# EAGLE design power (EAGLE 9.2.2)
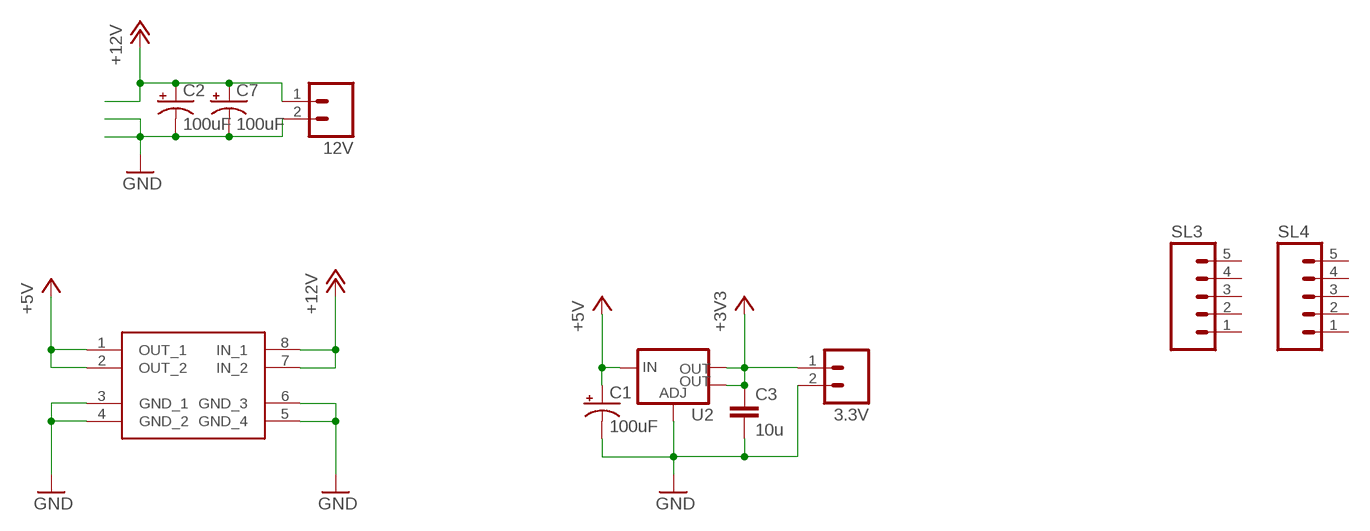
[diagram p0: schematic, sheet 1]

## Parts
3.3V  M02  [02P]
12V  M02  [02P]
C1  100uF  100UF-POLAR-EIA7343-16V-10%(TANT)  [EIA7343]
C2  100uF  100UF-POLAR-EIA7343-16V-10%(TANT)  [EIA7343]
C3  10u  C-EUC1206  [C1206]
C7  100uF  100UF-POLAR-EIA7343-16V-10%(TANT)  [EIA7343]
SL3  M05  [05P]
SL4  M05  [05P]
U2  V_REG_LM1117SOT223  [SOT223]
U$1  MP1584_MODUL  [MP1584_MODUL]

## Nets
+3V3: 3.3V.1 C3.1 U2.2(OUT) U2.4(OUT)
+5V: C1.A(+) U2.3(IN) U$1.1(OUT_1) U$1.2(OUT_2)
+12V: 12V.1 C2.A(+) C7.A(+) U$1.7(IN_2) U$1.8(IN_1)
GND: 3.3V.2 12V.2 C1.C(-) C2.C(-) C3.2 C7.C(-) U2.1(ADJ) U$1.3(GND_1) U$1.4(GND_2) U$1.5(GND_4) U$1.6(GND_3)
Unconnected: SL3.1 SL3.2 SL3.3 SL3.4 SL3.5 SL4.1 SL4.2 SL4.3 SL4.4 SL4.5

## Library data of the parts
3.3V 12V = con-amp-quick:M02: AMP QUICK CONNECTOR; OC_FARNELL: unknown; OC_NEWARK: unknown
C1 C2 C7 = SparkFun-Capacitors:100UF-POLAR: 100µF polarized capacitors A capacitor is a passive two-terminal electrical component used to store electrical energy temporarily in an electric field.; PROD_ID: CAP-08702
C3 = rcl:C-EU: CAPACITOR, European symbol; SPICEPREFIX: C
SL3 SL4 = con-amp-quick:M05: AMP QUICK CONNECTOR; OC_FARNELL: unknown; OC_NEWARK: unknown
U2 = SparkFun-IC-Power:V_REG_LM1117: Voltage Regulator LM1117 Standard adjustable voltage regulator but in SMD form. Spark Fun Electronics SKU : COM-00595; PROD_ID: VREG-08170
U$1 = my_components:MP1584_MODUL

## Board
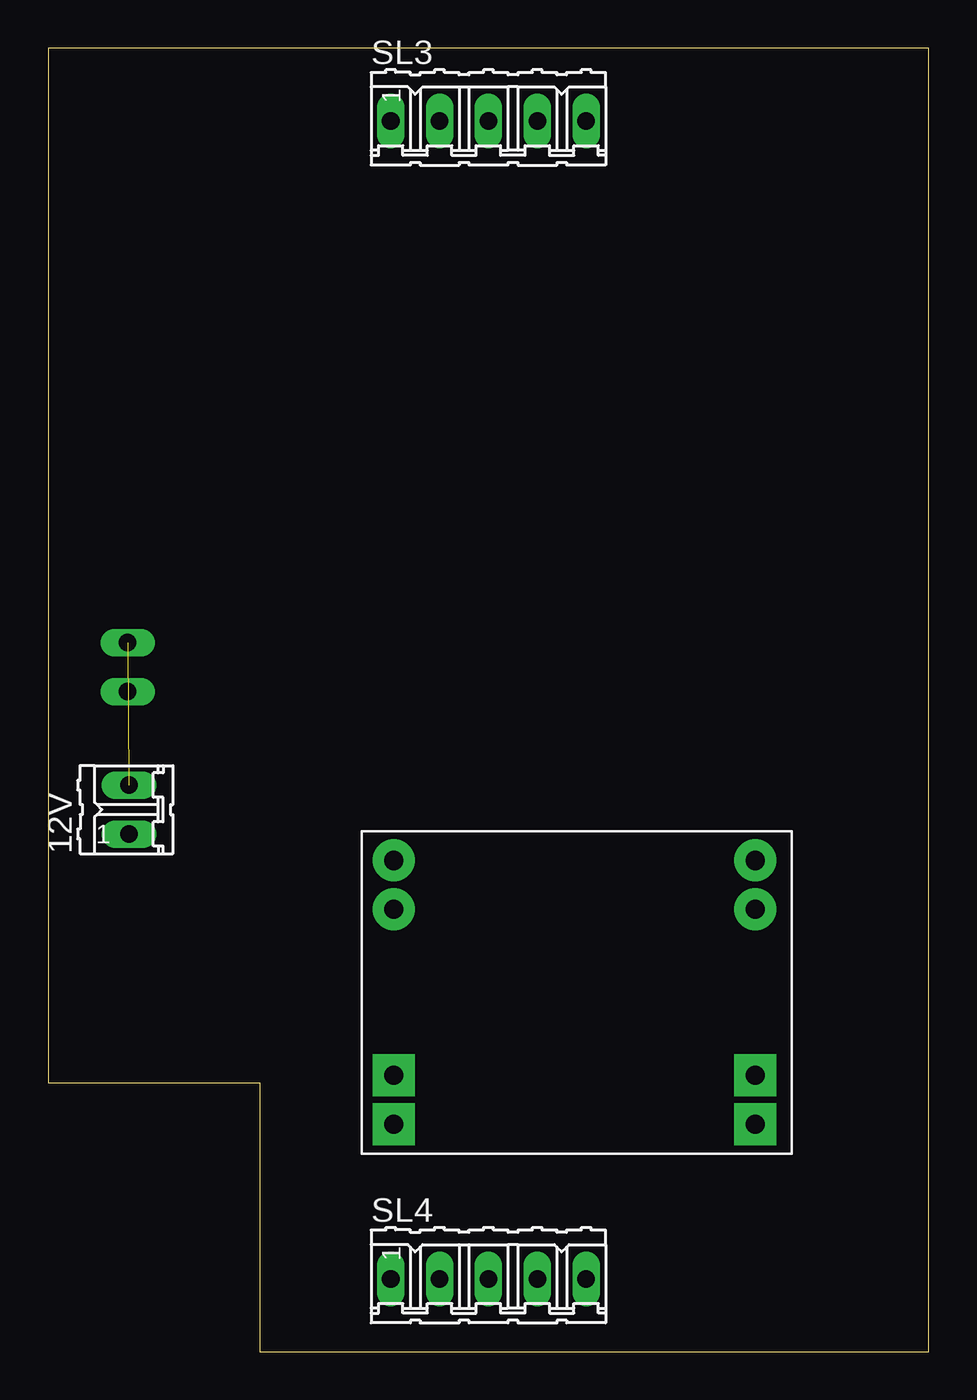
[diagram p1: board, top side]
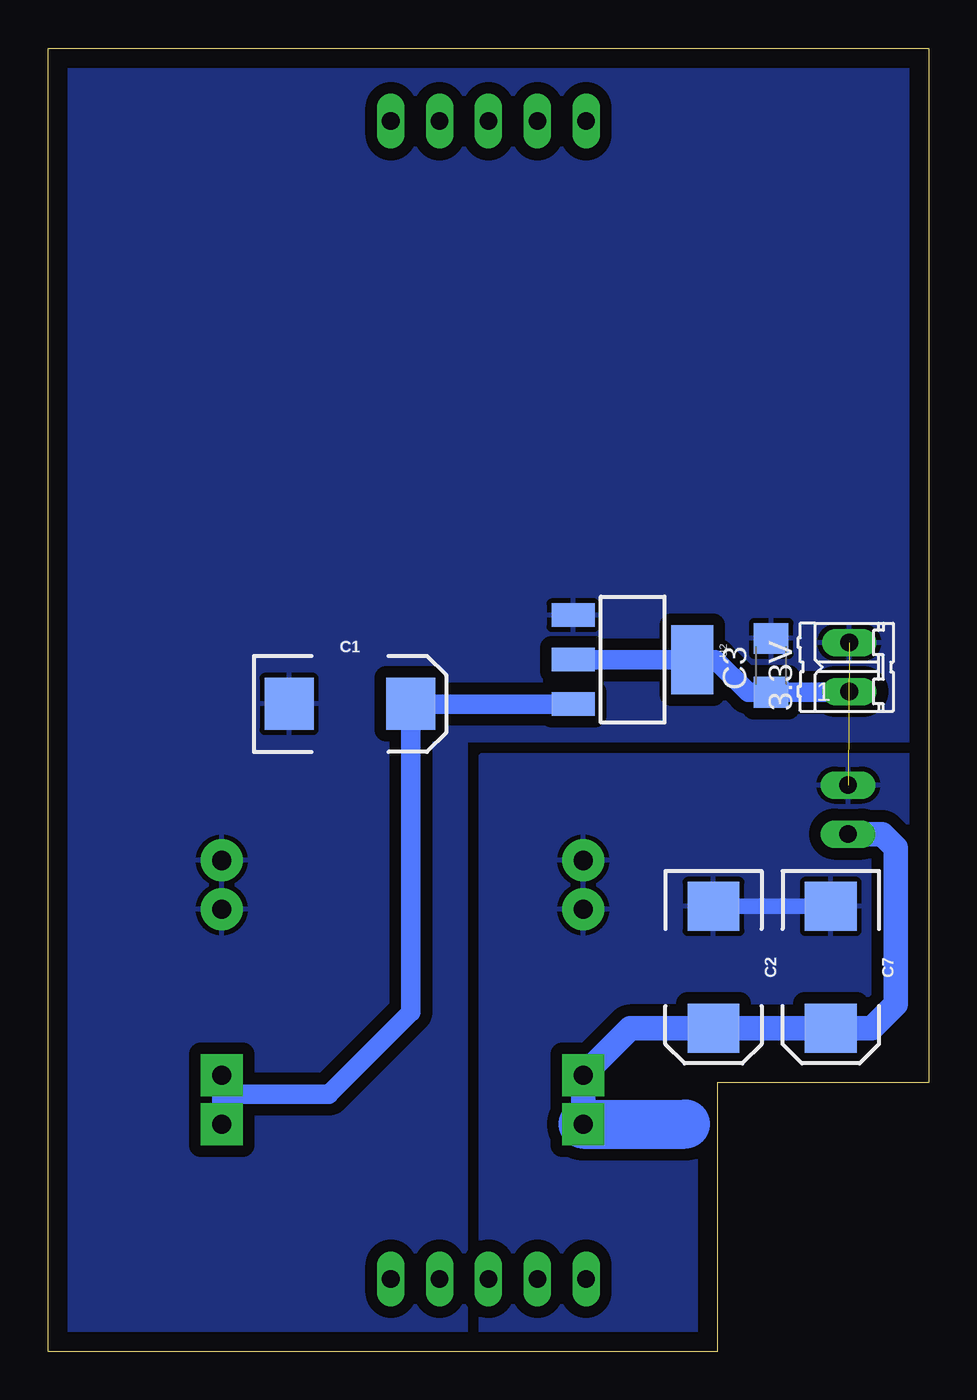
[diagram p2: board, bottom side, seen from below]

Size 45.8 x 67.8 mm. Coordinates in mm from the lower left corner, seen from the top.
Outline: 11,0 45.8,0 45.8,67.8 0,67.8 0,14 11,14 11,0
Copper layers (1*16): Top 0.035mm / dielectric 1.5mm / Bottom 0.035mm
Design rules "default": minimum track width 10mil, minimum drill 24mil, track to track 8mil, track to pad 8mil, pad to pad 8mil, via to via 8mil, smd to smd 8mil, copper to edge 40mil, drill to drill 8mil, minimum pad ring 10mil, minimum via ring 8mil, stop-mask expansion 4mil, vias tented up to drill 0mil, thermal gap 10mil

### Footprints (pad centres in the part's own frame; a part is rotated, then mirrored left to right if it is on the bottom)
02P = drill 0.914 long: 1 -1.27,0; 2 1.27,0
EIA7343 = smd 2.55 x 2.7: A 3.17,0; C -3.17,0
C1206 = smd 1.6 x 1.8: 1 -1.4,0; 2 1.4,0
05P = drill 0.914 long: 1 -5.08,0; 2 -2.54,0; 3 0,0; 4 2.54,0; 5 5.08,0
SOT223 = smd 1.219 x 2.235: 1 -2.311,-3.099; 2 0,-3.099; 3 2.311,-3.099 | smd 3.6 x 2.2: 4 0,3.099
MP1584_MODUL = drill 1 pad 2.184 square: 1 -9.271,6.858; 2 -9.271,4.318; 7 9.525,4.318; 8 9.525,6.858 | drill 1 pad 2.184: 3 -9.271,-4.318; 4 -9.271,-6.858; 5 9.525,-6.858; 6 9.525,-4.318

### Placement (x,y rotation side)
3.3V  4.14,35.61 90 bottom
12V  4.2,28.2 90 top
C1  30.1,33.7 0 bottom
C2  11.2,20 270 bottom
C3  8.2,35.7 90 bottom
C7  5.1,20 270 bottom
SL3  22.9,64 0 top
SL4  22.9,3.8 0 top
U2  15.4,36 270 bottom
U$1  27.5,18.7 180 top

### Tracks (layer width: path | path; a pad name or v marks a point on that pad's centre or on a via)
+3V3
  Bottom 1.016: 8.2,34.34 C3.1 | C3.1 4.14,34.3 3.3V.1 | C3.1 9.4,34.3 11.1,36 U2.4 U2.2
+5V
  Bottom 1.016: U$1.1 36.77,13.3 | 36.77,13.3 U$1.2 | U2.3 C1.A 26.93,17.67 31.2,13.4 36.67,13.4 36.77,13.3
+12V
  Bottom 1.27: U$1.8 U$1.7 15.53,16.83 C2.A C7.A 2.97,16.83 1.73,18.07 1.73,26.23 2.43,26.93 12V.1
  Bottom 2.54: U$1.8 12.66,11.84
GND  (1 unrouted)
  Bottom 0.813: C7.C C2.C
  pour Bottom (isolate 0.61): 1,31.8 24.1,31.8 24.1,0.4 45.5,0.4 45.5,67.5 1,67.5
  pour Bottom (isolate 0.61): 23.3,31 23.3,0.4 11.2,0.4 11.2,14.3 0.2,14.3 0.2,31